# EAGLE design Board (EAGLE 9.5.2)
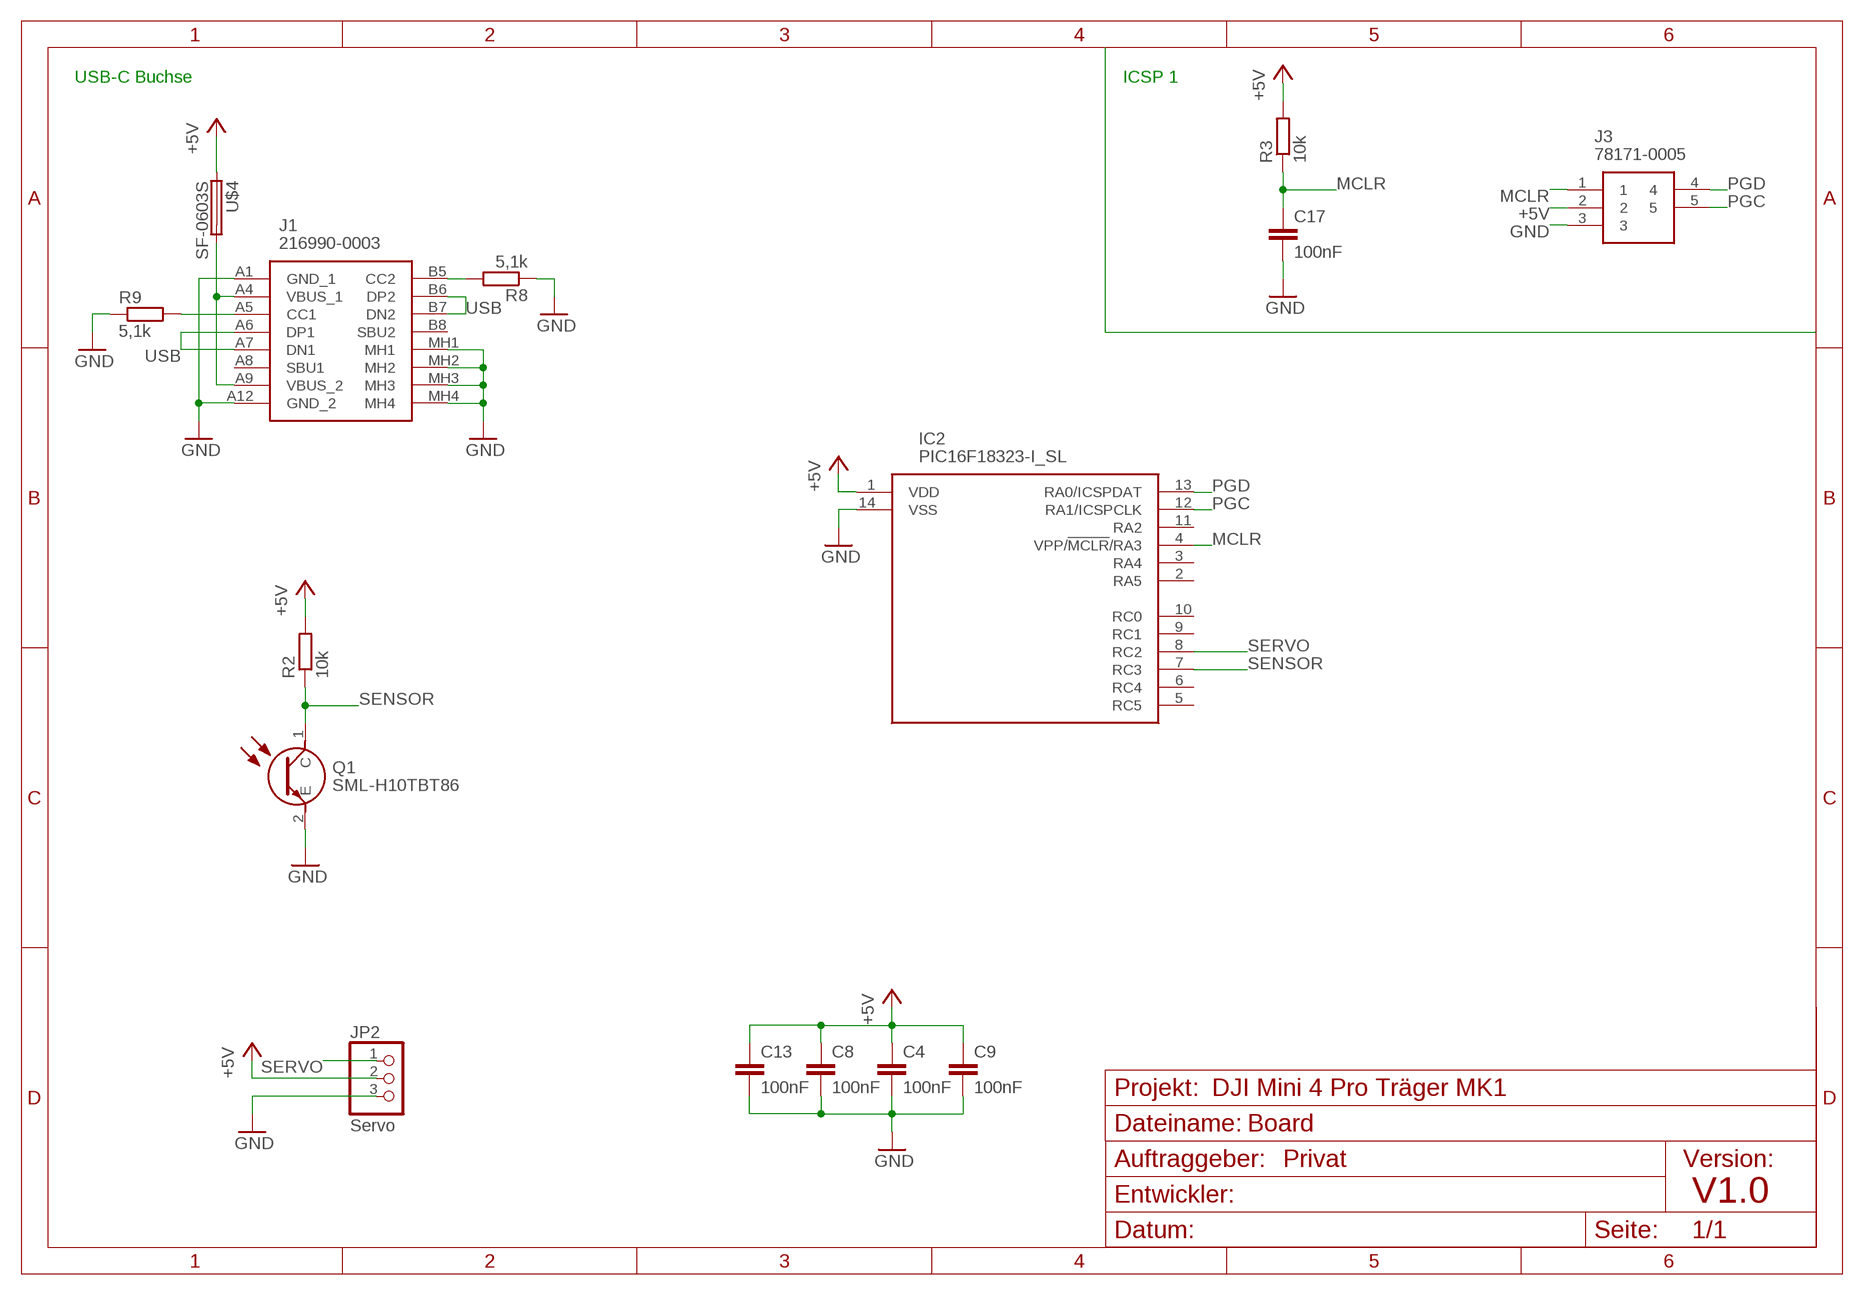
[diagram p0: schematic, sheet 1]

## Parts
C4  100nF  C-EUC0805  [C0805]
C8  100nF  C-EUC0805  [C0805]
C9  100nF  C-EUC0805  [C0805]
C13  100nF  C-EUC0805  [C0805]
C17  100nF  C-EUC0805  [C0805]
IC2  PIC16F18323-I_SL  [SOIC127P600X175-14N]
J1  216990-0003  [2169900003]
J3  78171-0005  [78171-0005]
JP2  Servo  PINHD-1X3/90  [1X03/90]
Q1  SML-H10TBT86  [SMLH10TBT86]
R2  10k  R-EU_R0805  [R0805]
R3  10k  R-EU_R0805  [R0805]
R8  5,1k  R-EU_R0805  [R0805]
R9  5,1k  R-EU_R0805  [R0805]
U$4  SF-0603S  [R0603]

## Nets
+5V: C4.1 C8.1 C9.1 C13.1 IC2.1(VDD) J3.2 JP2.2 R2.2 R3.2 U$4.1
GND: C4.2 C8.2 C9.2 C13.2 C17.2 IC2.14(VSS) J1.A1(GND_1) J1.A12(GND_2) J1.MH1 J1.MH2 J1.MH3 J1.MH4 J3.3 JP2.3 Q1.2(E) R8.1 R9.1
MCLR: C17.1 IC2.4(VPP/!MCLR!/RA3) J3.1 R3.1
N$10: J1.A4(VBUS_1) J1.A9(VBUS_2) U$4.2
N$12: J1.A5(CC1) R9.2
N$13: J1.B5(CC2) R8.2
PGC: IC2.12(RA1/ICSPCLK) J3.5
PGD: IC2.13(RA0/ICSPDAT) J3.4
SENSOR: IC2.7(RC3) Q1.1(C) R2.1
SERVO: IC2.8(RC2) JP2.1
USB: J1.A6(DP1) J1.A7(DN1) J1.B6(DP2) J1.B7(DN2)
Unconnected: IC2.2(RA5) IC2.3(RA4) IC2.5(RC5) IC2.6(RC4) IC2.9(RC1) IC2.10(RC0) IC2.11(RA2) J1.A8(SBU1) J1.B8(SBU2)

## Notes on the sheet
- USB-C Buchse | ICSP 1
- DJI Mini 4 Pro Träger MK1
- Privat
- V1.0

## Library data of the parts
C4 C8 C9 C13 C17 = rcl:C-EU: CAPACITOR, European symbol; SPICEPREFIX: C
IC2 = PIC16F18323-I_SL:PIC16F18323-I_SL: Microchip PIC16F18323-I/SL, 8bit PIC Microcontroller, 32MHz, 3.5 kB Flash, 14-Pin SOIC Source: Datasheet; DESCRIPTION: Microchip PIC16F18323-I/SL, 8bit PIC Microcontroller, 32MHz, 3.5 kB Flash, 14-Pin SOIC; HEIGHT: 1.75mm; MANUFACTURER_NAME: Microchip; MANUFACTURER_PART_NUMBER: PIC16F18323-I/SL; MOUSER_PART_NUMBER: 579-PIC16F18323-I/SL; MOUSER_PRICE-STOCK: https://www.mouser.co.uk/ProductDetail/Microchip-Technology/PIC16F18323-I-SL?qs=PQDAUpz3sUPi%252BDkgsT8CSw%3D%3D
J1 = 216990-0003:216990-0003: USB Connectors Mid-Mnt SMT CH0.58 16Ckt Type C Rec. Source: Datasheet <https://www.molex.com/pdm_docs/sd/2169900003_sd.pdf>; DESCRIPTION: USB Connectors Mid-Mnt SMT CH0.58 16Ckt Type C Rec.; HEIGHT: 3.36mm; MANUFACTURER_NAME: Molex; MANUFACTURER_PART_NUMBER: 216990-0003; MOUSER_PART_NUMBER: 538-216990-0003; MOUSER_PRICE-STOCK: https://www.mouser.co.uk/ProductDetail/Molex/216990-0003?qs=DRkmTr78QASn0GILUGAYCA%3D%3D
J3 = 78171-0005:78171-0005: Pico-Ezmate SMT PCB header, 5w Molex PICO-EZMATE Series, Series Number 78171, 1.2mm Pitch 5 Way 1 Row Shrouded Straight PCB Header, Surface Mount Source: Datasheet <http://www.molex.com/webdocs/datasheets/pdf/en-us//0781710005_PCB_HEADERS.pdf>; DESCRIPTION: Pico-Ezmate SMT PCB header, 5w Molex PICO-EZMATE Series, Series Number 78171, 1.2mm Pitch 5 Way 1 Row Shrouded Straight PCB Header, Surface Mount; HEIGHT: mm; MANUFACTURER_NAME: Molex; MANUFACTURER_PART_NUMBER: 78171-0005; MOUSER_PART_NUMBER: 538-78171-0005; MOUSER_PRICE-STOCK: https://www.mouser.co.uk/ProductDetail/Molex/78171-0005?qs=rg3U%2F5nEhHdPdhFREztkLQ%3D%3D
JP2 = pinhead:PINHD-1X3: PIN HEADER
Q1 = SML-H10TBT86:SML-H10TBT86: Surface mount Phototransistor: ROHM's optical sensors serve as eyes to monitor changes of any motions, and comply with customer's day-to-day diversifying requests. Source: Datasheet; DESCRIPTION: Surface mount Phototransistor: ROHM's optical sensors serve as eyes to monitor changes of any motions, and comply with customer's day-to-day diversifying requests.; HEIGHT: 1.15mm; MANUFACTURER_NAME: ROHM Semiconductor; MANUFACTURER_PART_NUMBER: SML-H10TBT86; MOUSER_PART_NUMBER: 755-SML-H10TBT86; MOUSER_PRICE-STOCK: https://www.mouser.co.uk/ProductDetail/ROHM-Semiconductor/SML-H10TBT86?qs=tlR8i4ZVbUfBuQ6kpSlkig%3D%3D
R2 R3 R8 R9 = rcl:R-EU_: RESISTOR, European symbol; SPICEPREFIX: R
U$4 = Eigene Library:SF-0603S; FARNELL: 1652144

## Board
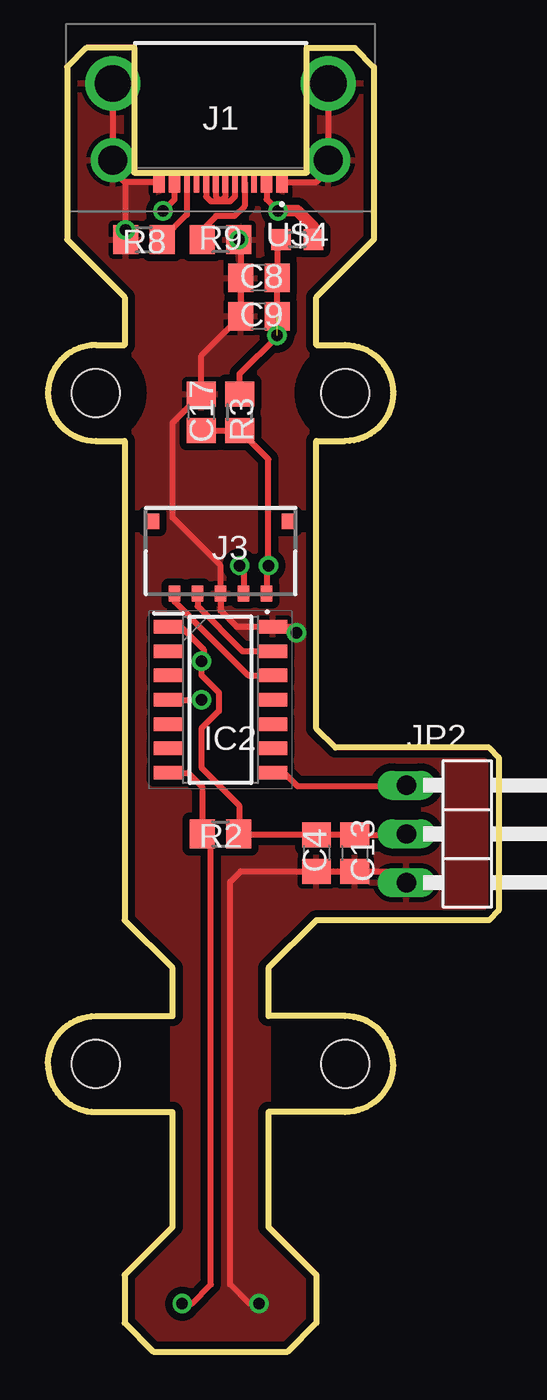
[diagram p1: board, top side]
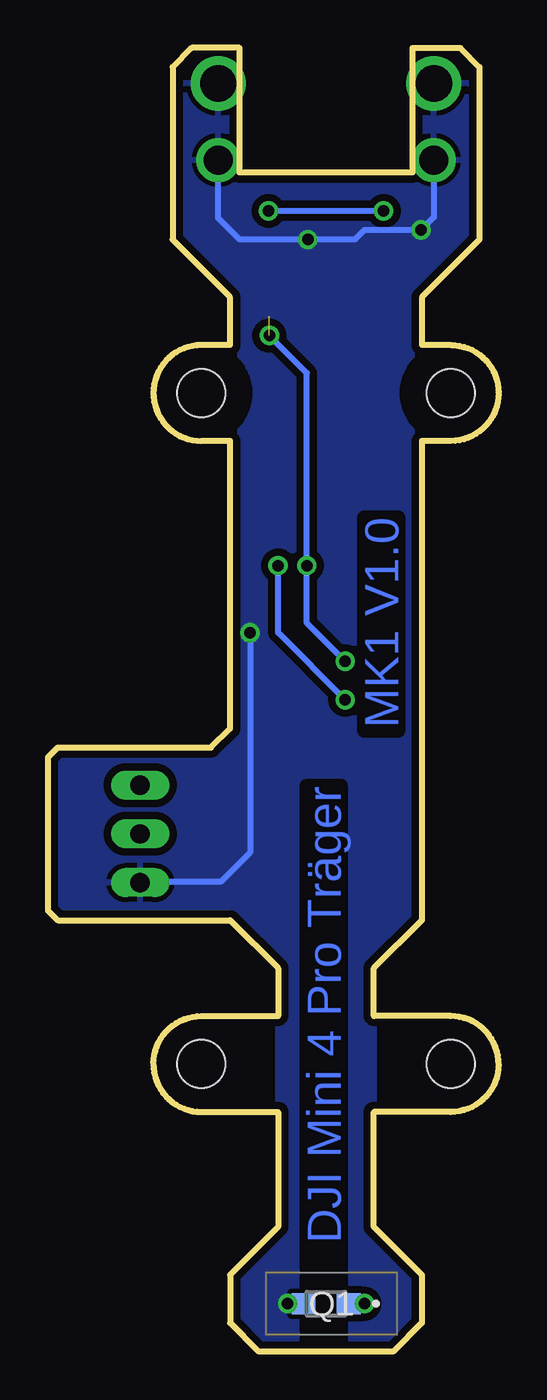
[diagram p2: board, bottom side, seen from below]

Size 23.5 x 68 mm. Coordinates in mm from the lower left corner, seen from the top.
Outline: 4.5,68 4.5,61.5 13.5,61.5 13.5,68 16,68 17,67 17,58 14,55 14,52.5 15.5,52.5 arc-90 18,50 arc-90 15.5,47.5 14,47.5 14,32.5 15,31.5 23,31.5 23.5,31 23.5,23 23,22.5 14,22.5 11.5,20 11.5,17.5 15.5,17.5 arc-90 18,15 arc-90 15.5,12.5 11.5,12.5 11.5,6.5 14,4 14,1.5 12.5,0 5.5,0 4,1.5 4,4 6.5,6.5 6.5,12.5 2.5,12.5 arc-90 0,15 arc-90 2.5,17.5 6.5,17.5 6.5,20 4,22.5 4,47.5 2.5,47.5 arc-90 0,50 arc-90 2.5,52.5 4,52.5 4,55 1,58 1,67 2,68 4.5,68
Copper layers (1*16): Top 0.035mm / dielectric 1.5mm / Bottom 0.035mm
Design rules "Torben": minimum track width 12mil, minimum drill 0.6mm, track to track 15mil, track to pad 8mil, pad to pad 6mil, via to via 6mil, smd to smd 6mil, copper to edge 15mil, drill to drill 6mil, minimum pad ring 10mil, minimum via ring 8mil, stop-mask expansion 4mil, vias tented up to drill 0mil, thermal gap 10mil
Holes 2.5 mm at 15.5,50 2.5,50 15.5,15 2.5,15

### Footprints (pad centres in the part's own frame; a part is rotated, then mirrored left to right if it is on the bottom)
C0805 = smd 1.3 x 1.5: 1 -0.95,0; 2 0.95,0
SOIC127P600X175-14N = smd 1.525 x 0.7: 1 -2.712,3.81; 2 -2.712,2.54; 3 -2.712,1.27; 4 -2.712,0; 5 -2.712,-1.27; 6 -2.712,-2.54; 7 -2.712,-3.81; 8 2.712,-3.81; 9 2.712,-2.54; 10 2.712,-1.27; 11 2.712,0; 12 2.712,1.27; 13 2.712,2.54; 14 2.712,3.81
2169900003 = smd 0.6 x 1.1: A1 -3.2,4; A4 -2.4,4; A9 2.4,4; A12 3.2,4 | smd 0.3 x 1.1: A5 -1.25,4; A6 -0.25,4; A7 0.25,4; A8 1.25,4; B5 1.75,4; B6 0.75,4; B7 -0.75,4; B8 -1.75,4 | drill 1.52 pad 2.28: MH1 -5.62,2.85; MH4 5.62,2.85 | drill 1.9 pad 2.85: MH2 -5.62,-1.15; MH3 5.62,-1.15
78171-0005 = smd 0.6 x 0.85: 1 -2.4,-0.041; 2 -1.2,-0.041; 3 0,-0.041; 4 1.2,-0.041; 5 2.4,-0.041 | smd 0.7 x 0.8: 6 -3.55,-3.816; 7 3.55,-3.816
1X03/90 = drill 1.016 long: 1 -2.54,-3.81; 2 0,-3.81; 3 2.54,-3.81
SMLH10TBT86 = smd 1.25 x 1.1: 1 -1.175,0; 2 1.175,0
R0805 = smd 1.3 x 1.5: 1 -0.95,0; 2 0.95,0
R0603 = smd 1 x 1.1: 1 -0.85,0; 2 0.85,0

### Placement (x,y rotation side)
C4  14,26 270 top
C8  11,56 180 top
C9  11,54 180 top
C13  16,26 270 top
C17  8,49 90 top
IC2  9,34 0 top
J1  9,65 180 top
J3  9,39.5 180 top
JP2  22.5,27 270 top
Q1  9,2.5 180 bottom
R2  9,27 0 top
R3  10,49 90 top
R8  5,58 0 top
R9  9,58 180 top
U$4  13,58 0 top

### Tracks (layer width: path | path; a pad name or v marks a point on that pad's centre or on a via)
+5V  (via drill 0.6)  (1 unrouted)
  Top 0.305: U$4.1 11.95,57.8 C8.1 C9.1 11.95,52.95 10,51 R3.2 | JP2.2 18.64,26.95 C13.1 C4.1 10,26.95 9.98,26.98 | 9.98,26.98 R2.2 | IC2.1 6.93,37.81 8.12,36.62 8.12,36.12 v8,36 8,35.29 8.91,34.38 8.91,33.41 8,32.5 8,30.47 9.98,28.5 9.98,26.98 | v10,41 10.2,40.8 J3.2
  Top 0.61: 11.95,58 U$4.1
  Bottom 0.305: v8,36 10,38 v10,41 10,51.05 v11.95,53
GND  (via drill 0.6)
  Top 0.305: J1.MH2 J1.MH1 | J1.MH3 3.38,66 | 3.38,66 J1.MH4 | J1.A12 4,61 | J1.MH4 3.38,61.62 4,61 | J1.A1 14,61 14.62,61.62 J1.MH1 | J1.MH1 15,61.77 | 2.73,65.35 3.38,66 | v4.05,58.5 4,58.45 | 10.05,58 R9.1 10.05,57.9 C8.2 C9.2 8,51.95 C17.2 7.11,49.06 7.1,49.06 6.5,48.45 6.5,43.5 9,41 J3.3 9,38.65 9.84,37.81 IC2.14 12.65,37.81 v12.96,37.5 | v4.05,58.5 4.05,60.95 4,61 | v4.05,58.5 4.05,60 | R8.1 v4.05,58.5 | 4.05,58.1 v4.05,58.5 | 3.17,61.94 J1.MH4 | JP2.3 18.1,25.05 C13.2 C4.2 10.05,25.05 9.5,24.5 9.5,3.5 10.5,2.5 v11,2.5
  Bottom 0.305: 9.98,2.69 Q1.2 v11,2.5 | JP2.3 18.65,24.5 14.5,24.5 12.96,26.04 v12.96,37.5 | J1.MH1 14.62,59.12 13.5,58 R9.1 7.5,58 7,58.5 v4.05,58.5 3.38,59.17 J1.MH4
  other vias: 9.95,58
  pour Top: 4.5,68 2,68 1,67 1,58 4,55 4,45 4,22.5 6.5,20 6.5,17.5 6.5,6.5 4,4 4,1.5 5.5,0 12.5,0 14,1.5 14,4 11.5,6.5 11.5,20 14,22.5 23,22.5 23.5,23 23.5,31 23,31.5 15,31.5 14,32.5 14,47.5 14,55 17,58 17,67 16,68
  pour Bottom: 16,68 2,68 1,67 1,58 4,55 4,22.5 6.5,20 6.5,6.5 4,4 4,1.5 5.5,0 12.5,0 14,1.5 14,4 11.5,6.5 11.5,20 14,22.5 23,22.5 23.5,23 23.5,31 23,31.5 15,31.5 14,32.5 14,55 17,58 17,67
  cutout Top: 2.5,52.5 arc90 0,50 arc90 2.5,47.5 arc90 5,50 arc90
  cutout Top: 15.5,52.5 arc90 13,50 arc90 15.5,47.5 arc90 18,50 arc90
  cutout Bottom: 2.5,52.5 arc90 0,50 arc90 2.5,47.5 arc90 5,50 arc90
  cutout Bottom: 15.5,52.5 arc90 13,50 arc90 15.5,47.5 arc90 18,50 arc90
MCLR  (via drill 0.6)
  Top 0.305: IC2.4 v8,34 | J3.1 11.4,40.9 v11.5,41 11.5,46.55 R3.1 C17.1
  Bottom 0.305: v8,34 11.5,37.5 v11.5,41
N$10  (via drill 0.6)
  Top 0.305: J1.A4 11.4,60.1 v12,59.5 | v6,59.5 6.6,60.1 J1.A9
  Top 0.61: v12,59.5 13,59.5 13.85,58.65 U$4.2
  Bottom 0.305: v12,59.5 v6,59.5
N$12
  Top 0.305: R9.2 8.05,58.5 8.77,59.23 9.73,59.23 10.25,59.75 J1.A5
N$13
  Top 0.305: J1.B5 7.25,59.3 R8.2
PGC
  Top 0.305: J3.5 6.6,39.11 7.36,38.36 7.41,38.31 10.44,35.27 IC2.12
PGD
  Top 0.305: J3.4 7.8,38.88 10.14,36.54 IC2.13
SENSOR  (via drill 0.6)
  Top 0.305: v7,2.5 7.5,2.5 8.5,3.5 8.5,26.55 R2.1 8.05,29.45 7.31,30.19 IC2.7
  Bottom 0.305: Q1.1 v7,2.5
SERVO
  Top 0.305: IC2.8 12.31,30.19 13,29.5 18.65,29.5 JP2.1
USB
  Top 0.305: J1.B7 9.75,60.25 9.5,60 9,60 | 9,60 8.5,60 8.25,60.25 J1.B6 | J1.A7 8.75,60.25 9,60 | J1.A6 9.25,60.25 9,60

### Text on the board
Bottom: MK1 V1.0 | DJI Mini 4 Pro Träger